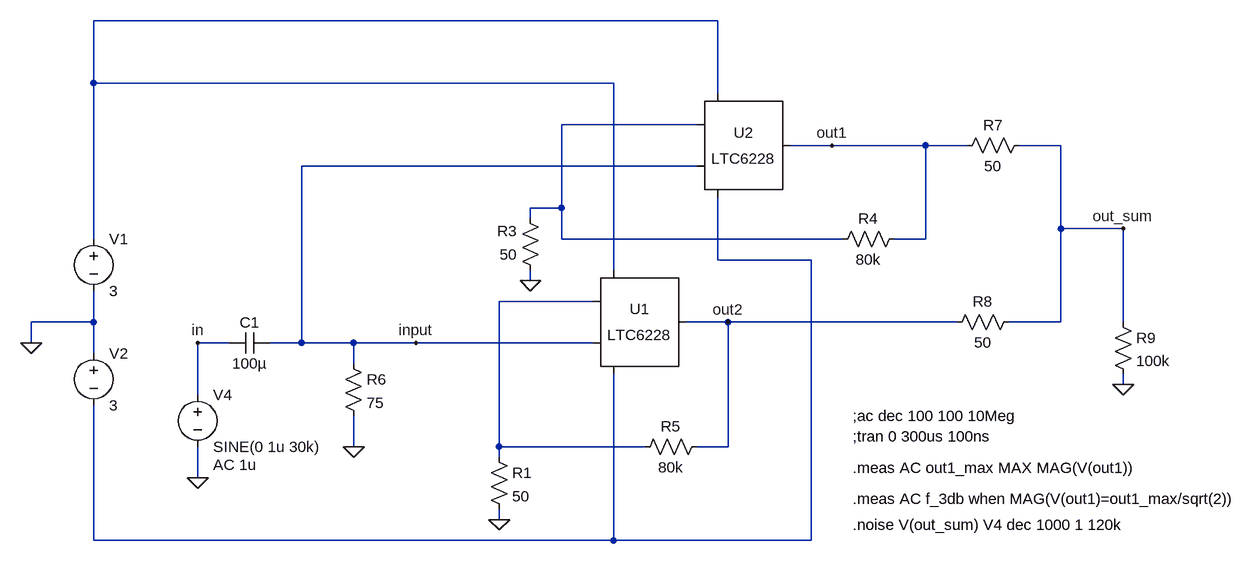
[diagram p0: schematic auspc_v3_ltc6228.asc]
auspc_v3_ltc6228.asc, the LTspice schematic file:
Version 4
SHEET 1 3680 680
WIRE 1616 -432 656 -432
WIRE 656 -336 656 -432
WIRE 1456 -336 656 -336
WIRE 1616 -320 1616 -432
WIRE 1584 -272 1376 -272
WIRE 1792 -240 1728 -240
WIRE 1936 -240 1792 -240
WIRE 2000 -240 1936 -240
WIRE 2144 -240 2080 -240
WIRE 1584 -208 976 -208
WIRE 1376 -144 1376 -272
WIRE 1376 -144 1328 -144
WIRE 1328 -128 1328 -144
WIRE 2144 -112 2144 -240
WIRE 2240 -112 2144 -112
WIRE 656 -96 656 -336
WIRE 1376 -96 1376 -144
WIRE 1808 -96 1376 -96
WIRE 1936 -96 1936 -240
WIRE 1936 -96 1888 -96
WIRE 1616 -64 1616 -160
WIRE 1760 -64 1616 -64
WIRE 1456 -48 1456 -336
WIRE 1328 -32 1328 -48
WIRE 1424 0 1280 0
WIRE 656 32 656 -16
WIRE 656 32 560 32
WIRE 1632 32 1568 32
WIRE 1984 32 1632 32
WIRE 2144 32 2144 -112
WIRE 2144 32 2064 32
WIRE 2240 32 2240 -112
WIRE 560 64 560 32
WIRE 864 64 816 64
WIRE 976 64 976 -208
WIRE 976 64 928 64
WIRE 1056 64 976 64
WIRE 1152 64 1056 64
WIRE 1424 64 1152 64
WIRE 656 80 656 32
WIRE 1056 96 1056 64
WIRE 2240 128 2240 112
WIRE 816 144 816 64
WIRE 1056 224 1056 176
WIRE 1280 224 1280 0
WIRE 1504 224 1280 224
WIRE 1632 224 1632 32
WIRE 1632 224 1584 224
WIRE 1280 240 1280 224
WIRE 816 272 816 224
WIRE 1280 336 1280 320
WIRE 656 368 656 160
WIRE 1456 368 1456 112
WIRE 1456 368 656 368
WIRE 1760 368 1760 -64
WIRE 1760 368 1456 368
FLAG 816 272 0
FLAG 1632 32 out2
FLAG 560 64 0
FLAG 1280 336 0
FLAG 1152 64 input
FLAG 1056 224 0
FLAG 1328 -32 0
FLAG 2240 128 0
FLAG 2240 -112 out_sum
FLAG 816 64 in
FLAG 1792 -240 out1
SYMBOL voltage 816 128 R0
WINDOW 123 24 124 Left 2
WINDOW 39 0 0 Left 0
SYMATTR Value2 AC 1u
SYMATTR InstName V4
SYMATTR Value SINE(0 1u 30k)
SYMBOL res 1600 208 R90
WINDOW 0 0 56 VBottom 2
WINDOW 3 32 56 VTop 2
SYMATTR InstName R5
SYMATTR Value 80k
SYMBOL voltage 656 -112 R0
WINDOW 123 0 0 Left 0
WINDOW 39 0 0 Left 0
SYMATTR InstName V1
SYMATTR Value 3
SYMBOL voltage 656 64 R0
WINDOW 123 0 0 Left 0
WINDOW 39 0 0 Left 0
SYMATTR InstName V2
SYMATTR Value 3
SYMBOL res 1264 224 R0
SYMATTR InstName R1
SYMATTR Value 50
SYMBOL res 1344 -32 R180
WINDOW 0 36 76 Left 2
WINDOW 3 36 40 Left 2
SYMATTR InstName R3
SYMATTR Value 50
SYMBOL res 1792 -80 R270
WINDOW 0 32 56 VTop 2
WINDOW 3 0 56 VBottom 2
SYMATTR InstName R4
SYMATTR Value 80k
SYMBOL res 2096 -256 R90
WINDOW 0 0 56 VBottom 2
WINDOW 3 32 56 VTop 2
SYMATTR InstName R7
SYMATTR Value 50
SYMBOL res 2080 16 R90
WINDOW 0 0 56 VBottom 2
WINDOW 3 32 56 VTop 2
SYMATTR InstName R8
SYMATTR Value 50
SYMBOL res 2224 16 R0
SYMATTR InstName R9
SYMATTR Value 100k
SYMBOL res 1040 80 R0
SYMATTR InstName R6
SYMATTR Value 75
SYMBOL OpAmps\\LTC6228 1456 32 R0
SYMATTR InstName U1
SYMBOL OpAmps\\LTC6228 1616 -240 R0
SYMATTR InstName U2
SYMBOL cap 928 48 R90
WINDOW 0 0 32 VBottom 2
WINDOW 3 32 32 VTop 2
SYMATTR InstName C1
SYMATTR Value 100µ
TEXT 1824 176 Left 2 !;ac dec 100 100 10Meg
TEXT 1824 208 Left 2 !;tran 0 300us 100ns
TEXT 1824 256 Left 2 !.meas AC out1_max MAX MAG(V(out1))
TEXT 1824 344 Left 2 !.noise V(out_sum) V4 dec 1000 1 120k
TEXT 1824 304 Left 2 !.meas AC f_3db when MAG(V(out1)=out1_max/sqrt(2))

The netlist it stands for:
* auspc_v3_ltc6228.asc
V4 in 0 SINE(0 1u 30k) AC 1u
R5 out2 N004 80k
V1 N001 0 3
V2 0 N003 3
R1 N004 0 50
R3 0 N002 50
R4 N002 out1 80k
R7 out_sum out1 50
R8 out_sum out2 50
R9 out_sum 0 100k
R6 input 0 75
XU1 input N004 out2 N001 N003 NC_01 LTC6228
XU2 input N002 out1 N001 N003 NC_02 LTC6228
C1 input in 100µ
;ac dec 100 100 10Meg
;tran 0 300us 100ns
.meas AC out1_max MAX MAG(V(out1))
.noise V(out_sum) V4 dec 1000 1 120k
.meas AC f_3db when MAG(V(out1)=out1_max/sqrt(2))
.backanno
.end